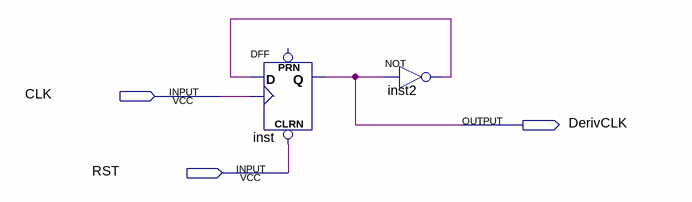
[diagram p0: schematic sheet]
// Quartus schematic divby2.bdf as structural Verilog: 2 symbols, 3 pins
module divby2 (
  input  CLK,
  input  RST,
  output DerivCLK
);

  wire inst2_out;

  DFF inst (.CLRN(RST), .CLK(CLK), .D(inst2_out), .Q(DerivCLK));  // open: PRN
  not inst2 (inst2_out, DerivCLK);
endmodule
